# Altium schematic sheet Outputs.SchDoc: Outputs
size A4; SheetNumber: 4; SheetTotal: 8
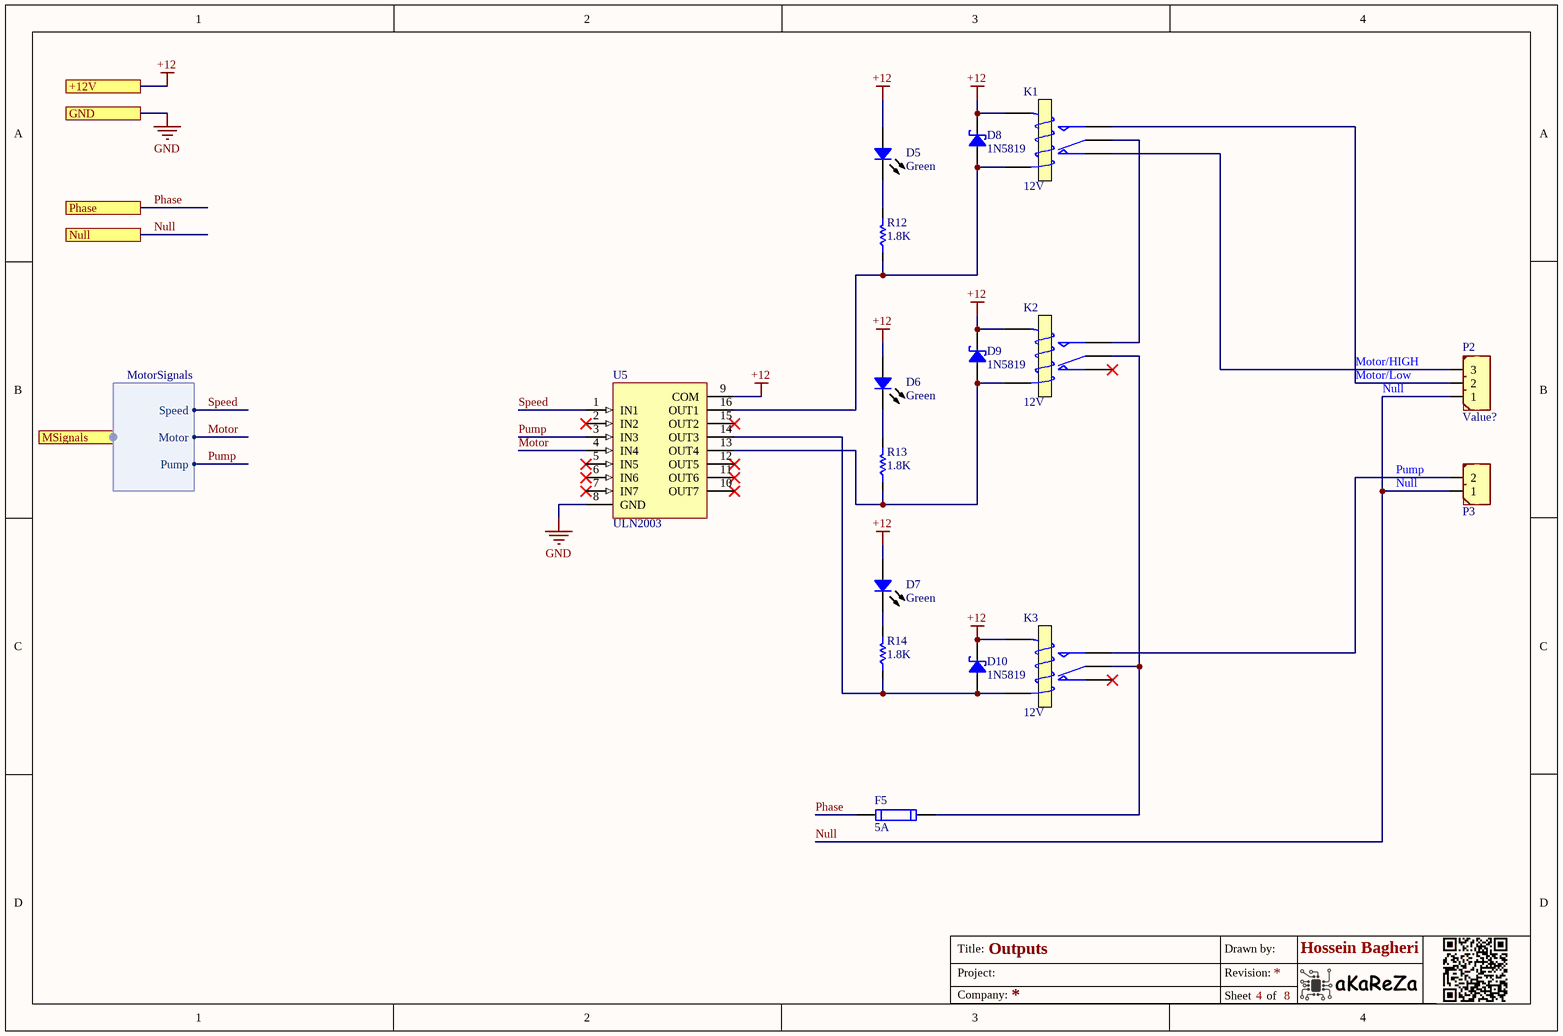
[diagram p0: Outputs.SchDoc]

## Parts
D5  Green  [LED 0805/2012 GREEN]
D6  Green  [LED 0805/2012 GREEN]
D7  Green  [LED 0805/2012 GREEN]
D8  1N5819  [430X270D]
D9  1N5819  [430X270D]
D10  1N5819  [430X270D]
F5  5A  [FUSE_BLX_20x5]
K1  12V  [Relay 18.85x15.35x15.70]
K2  12V  [Relay 18.85x15.35x15.70]
K3  12V  [Relay 18.85x15.35x15.70]
P2  Value?  [Phoenix_3PIN_RA_P5.08mm]
P3  2'Pin  [Phoenix_2PIN_RA_P5.08mm]  (value not drawn)
R12  1.8K  [RES 0805 (2012X06L)]
R13  1.8K  [RES 0805 (2012X06L)]
R14  1.8K  [RES 0805 (2012X06L)]
U5  ULN2003  [SO16_M]

## Ports
+12V, GND, MSignals (harness MotorSignals), Null, Phase

## Harnesses
MotorSignals: Speed, Motor, Pump

## Nets
+12: D5.1 D6.1 D7.1 D8.2 D9.2 D10.2 K1.5(T2) K2.5(T2) K3.5(T2) U5.9(COM) ; port +12V
GND: U5.8(GND) ; port GND
Motor: U5.4(IN4) ; port MSignals.Motor
Null: P2.1 P3.1 ; port Null
Phase: F5.1 ; port Phase
Pump: U5.3(IN3) ; port MSignals.Pump
Speed: U5.1(IN1) ; port MSignals.Speed
NetD5_2: D5.2 R12.2
NetD6_2: D6.2 R13.2
NetD7_2: D7.2 R14.2
NetD8_1: D8.1 K1.4(T1) R12.1 U5.16(OUT1)
NetD9_1: D9.1 K2.4(T1) R13.1 U5.13(OUT4)
NetD10_1: D10.1 K3.4(T1) R14.1 U5.14(OUT3)
NetF5_2: F5.2 K2.1(COM) K3.1(COM)
NetK1_1: K1.1(COM) K2.3(NO)
NetK1_2: K1.2(NC) P2.3
NetK1_3: K1.3(NO) P2.2
NetK3_3: K3.3(NO) P3.2

Not connected (* = marked no-connect by the designer): K2 2(NC)*; K3 2(NC)*; U5 2(IN2)* 5(IN5)* 6(IN6)* 7(IN7)* 10(OUT7)* 11(OUT6)* 12(OUT5)* 15(OUT2)*

## Notes on the sheet
- (near P2) Motor/Low
- (near P2) Motor/HIGH
- Null
- (near P3) Null
- (near P3) Pump
- Title:
- Project:
- Drawn by:
- Revision:
- Hossein Bagheri
- Company:
- Sheet
- of

## Library data of the parts
D5-D7 = Semi_LED_SMD: LED; Inflow: inflow?; Rating: Rating?; Validation: Valid; Package: Package?; Type: LED; Value: Green
D8-D10 = Semi_Diod_Sch_1N5819_SMD: Schottky Rectifiers; Rating: Rating?; Validation: Valid; Inflow: inflow?; Package: SMA; Type: Schottky; Value: 1N5819
F5 = Other_Elec_Fuse_THT: Short circiut  protection; Type: Type?; Inflow: inflow?; Rating: Rating?; Validation: Valid; Package: Package?; Value: 5A
K1-K3 = SW_Relay_SPDT: SPDT Relay; Rating: Rating?; Validation: Valid; Inflow: inflow?; Type: SPDT; Package: Dip; Value: 12V
P2 = Con_Power_3: Power Connector 3'Pin; Rating: 3b; Inflow: inflow?; Validation: Valid; Package: Dip; Type: Type?; Value: Value?
P3 = Con_Power_2: Power Connector 2'Pin; Rating: Rating?; Validation: NT; Inflow: inflow?; Value: 2'Pin; Package: Package?; Type: Type?
R12-R14 = Res_SMD_0805: Resistor; Inflow: inflow?; Rating: 0.125W; Validation: Valid; Package: 0805; Type: 10%; Value: 1.8K
U5 = IC_Driver_ULN2003: Seven darlington array drivers; Rating: Rating?; Validation: Valid; Inflow: 1506; Package: SO-16; Type: Driver; Value: ULN2003